# EAGLE design TELEXb.v1.2 (EAGLE 8.6.0)
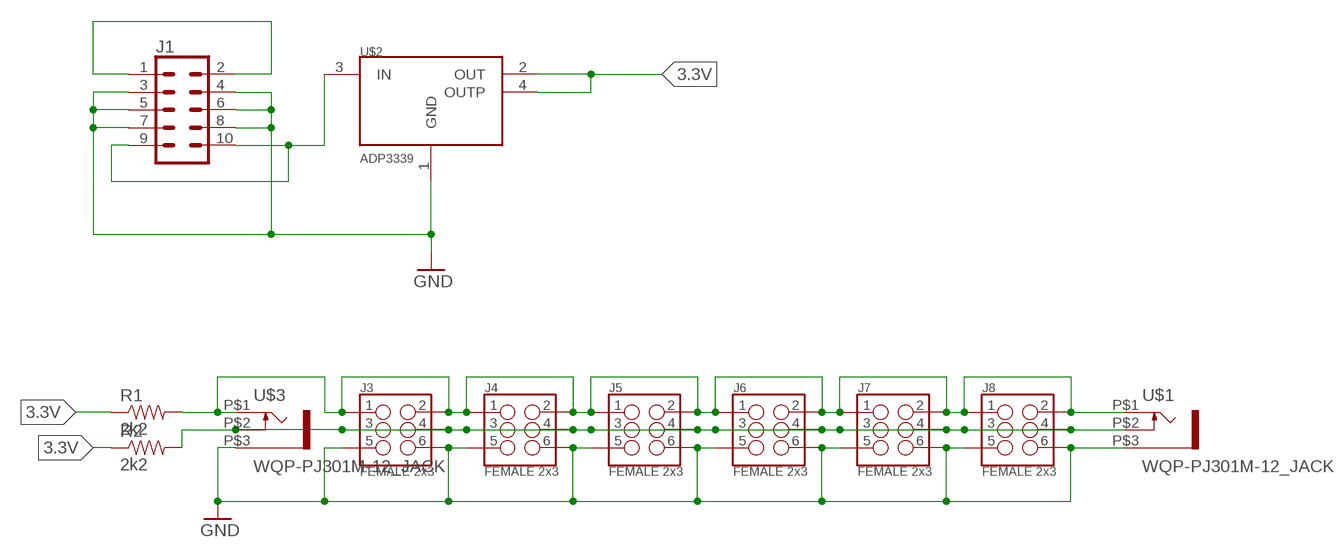
[diagram p0: schematic, sheet 1]

## Parts
J1  CONN_05X2SHD  [2X5-SHROUDED]
J3  FEMALE 2x3  CONN_03X2FEMALE  [2X3]
J4  FEMALE 2x3  CONN_03X2FEMALE  [2X3]
J5  FEMALE 2x3  CONN_03X2FEMALE  [2X3]
J6  FEMALE 2x3  CONN_03X2FEMALE  [2X3]
J7  FEMALE 2x3  CONN_03X2FEMALE  [2X3]
J8  FEMALE 2x3  CONN_03X2FEMALE  [2X3]
R1  2k2  RESISTOR1206  [1206]
R2  2k2  RESISTOR1206  [1206]
U$1  WQP-PJ301M-12_JACK  [WQP-PJ301M-12_JACK]
U$2  ADP3339  [SOT223]
U$3  WQP-PJ301M-12_JACK  [WQP-PJ301M-12_JACK]

## Nets
3.3V: R1.1 R2.1 U$2.2(OUT) U$2.4(OUTP)
GND: J1.3 J1.4 J1.5 J1.6 J1.7 J1.8 J3.5 J3.6 J4.5 J4.6 J5.5 J5.6 J6.5 J6.6 J7.5 J7.6 J8.5 J8.6 U$1.P$3 U$2.1(GND) U$3.P$3
N$1: J1.9 J1.10 U$2.3(IN)
N$2: J3.1 J3.2 J4.1 J4.2 J5.1 J5.2 J6.1 J6.2 J7.1 J7.2 J8.1 J8.2 R1.2 U$1.P$1 U$3.P$1
N$3: J1.1 J1.2
N$4: J3.3 J3.4 J4.3 J4.4 J5.3 J5.4 J6.3 J6.4 J7.3 J7.4 J8.3 J8.4 R2.2 U$1.P$2 U$3.P$2

## Library data of the parts
J1 = SparkFun-Connectors:CONN_05X2: Header 5x2 Standard 10-pin dual row 0.1" header. Commonly used with AVR-ISP. Use with Spark Fun Electronics SKU: PRT-00778
J3-J8 = SparkFun-Connectors:CONN_03X2: 2x3 .1" header. Shrouded, with keying- CONN-10681 SMT- CONN-11415 Pogo pins- HW-11044; PROD_ID: CONN-11566
R1 R2 = SparkFun-Passives:RESISTOR: Resistor Basic schematic elements and footprints for 0603, 1206, and PTH resistors.
U$1 U$3 = thonkiconn:WQP-PJ301M-12_JACK
U$2 = monome-extracted:ADP3339

## Board
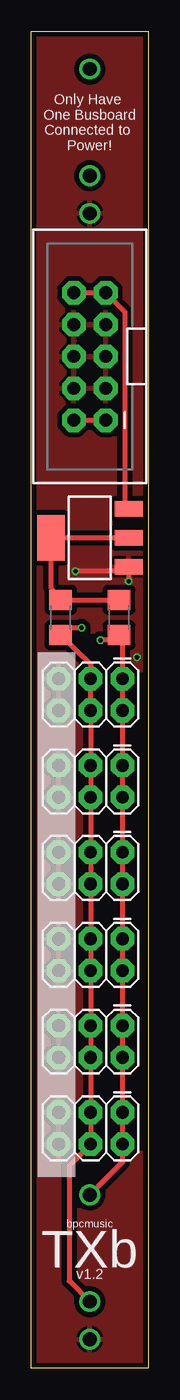
[diagram p1: board, top side]
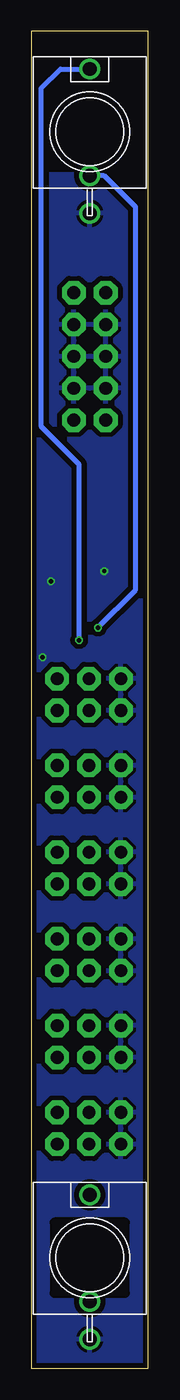
[diagram p2: board, bottom side, seen from below]

Size 9.3 x 106.5 mm. Coordinates in mm from the lower left corner, seen from the top.
Outline: 0,0 0,106.5 9.3,106.5 9.3,0 0,0
Copper layers (1*16): Top 0.035559375mm / dielectric 1.6mm / Bottom 0.035559375mm
Design rules "oshpark-2layer (1)": minimum track width 6mil, minimum drill 10mil, track to track 6mil, track to pad 6mil, pad to pad 6mil, via to via 6mil, smd to smd 6mil, copper to edge 15mil, drill to drill 6mil, minimum pad ring 5mil, minimum via ring 5mil, stop-mask expansion 2.5mil, vias tented up to drill 0mil, thermal gap 10mil

### Footprints (pad centres in the part's own frame; a part is rotated, then mirrored left to right if it is on the bottom)
2X5-SHROUDED = drill 1.016 pad 1.88 octagon: 1 -1.27,5.08; 2 1.27,5.08; 3 -1.27,2.54; 4 1.27,2.54; 5 -1.27,0; 6 1.27,0; 7 -1.27,-2.54; 8 1.27,-2.54; 9 -1.27,-5.08; 10 1.27,-5.08
2X3 = drill 1.016 pad 1.88 octagon: 1 0,0; 2 0,2.54; 3 2.54,0; 4 2.54,2.54; 5 5.08,0; 6 5.08,2.54
1206 = smd 1.6 x 1.8: 1 -1.4,0; 2 1.4,0
WQP-PJ301M-12_JACK = drill 1.1: P$1 0,5; P$2 0,-3.5; P$3 0,-6.5
SOT223 = smd 1.219 x 2.235: 1 -2.311,-3.099; 2 0,-3.099; 3 2.311,-3.099 | smd 3.6 x 2.2: 4 0,3.099

### Placement (x,y rotation side)
J1  4.65,80.6 180 top
J3  7.25,54.93 180 top
J4  7.25,48.02 180 top
J5  7.25,41.11 180 top
J6  7.25,34.2 180 top
J7  7.25,27.29 180 top
J8  7.25,20.38 180 top
R1  6.97,59.8 270 top
R2  2.33,59.8 270 top
U$1  4.65,8.8 0 bottom
U$2  4.65,66.15 90 top
U$3  4.65,98.5 0 bottom

### Tracks (layer width: path | path; a pad name or v marks a point on that pad's centre or on a via)
3.3V
  Top 0.406: U$2.2 U$2.4 1.55,62.17 R2.1 R1.1
GND  (via drill 0.35)
  Top 0.406: v7.75,62.7 U$2.1 7.41,63.5 v3.5,63.5
  other vias: 8.4,56.65
  pour Bottom (isolate 0.406): 0,0 0,106.5 13.9,106.5 13.9,0
  pour Top (isolate 0.406): 0,0 9.5,0 9.5,106.5 0,106.5
N$1
  Top 0.406: J1.10 J1.9 7.45,84.15 7.45,68.76 U$2.3
N$2  (via drill 0.35)
  Top 0.406: U$1.P$1 7.25,16.4 J8.2 J8.1 J7.2 J7.1 J6.2 J6.1 J5.2 J5.1 J4.2 J4.1 J3.2 J3.1 7.25,58.33 R1.2 6.38,58 v5.5,58
  Bottom 0.406: v5.5,58 5.5,72 8.5,75 8.5,102 7,103.5 U$3.P$1
N$3
  Top 0.406: J1.2 J1.1
N$4  (via drill 0.35)
  Top 0.406: U$1.P$2 3,6.95 3,16.13 J8.4 J8.3 J7.4 J7.3 J6.4 J6.3 J5.4 J5.3 J4.4 J4.3 J3.4 J3.3 4.71,56.12 R2.2 2.73,59 v4,59
  Bottom 0.406: v4,59 1,62 1,92.5 3.5,95 U$3.P$2

### Text on the board
tNames: Only Have / One Busboard / Connected to / Power! | bpcmusic | TXb | v1.2